# EAGLE design LTC6820 Test Board (EAGLE 9.6.2)
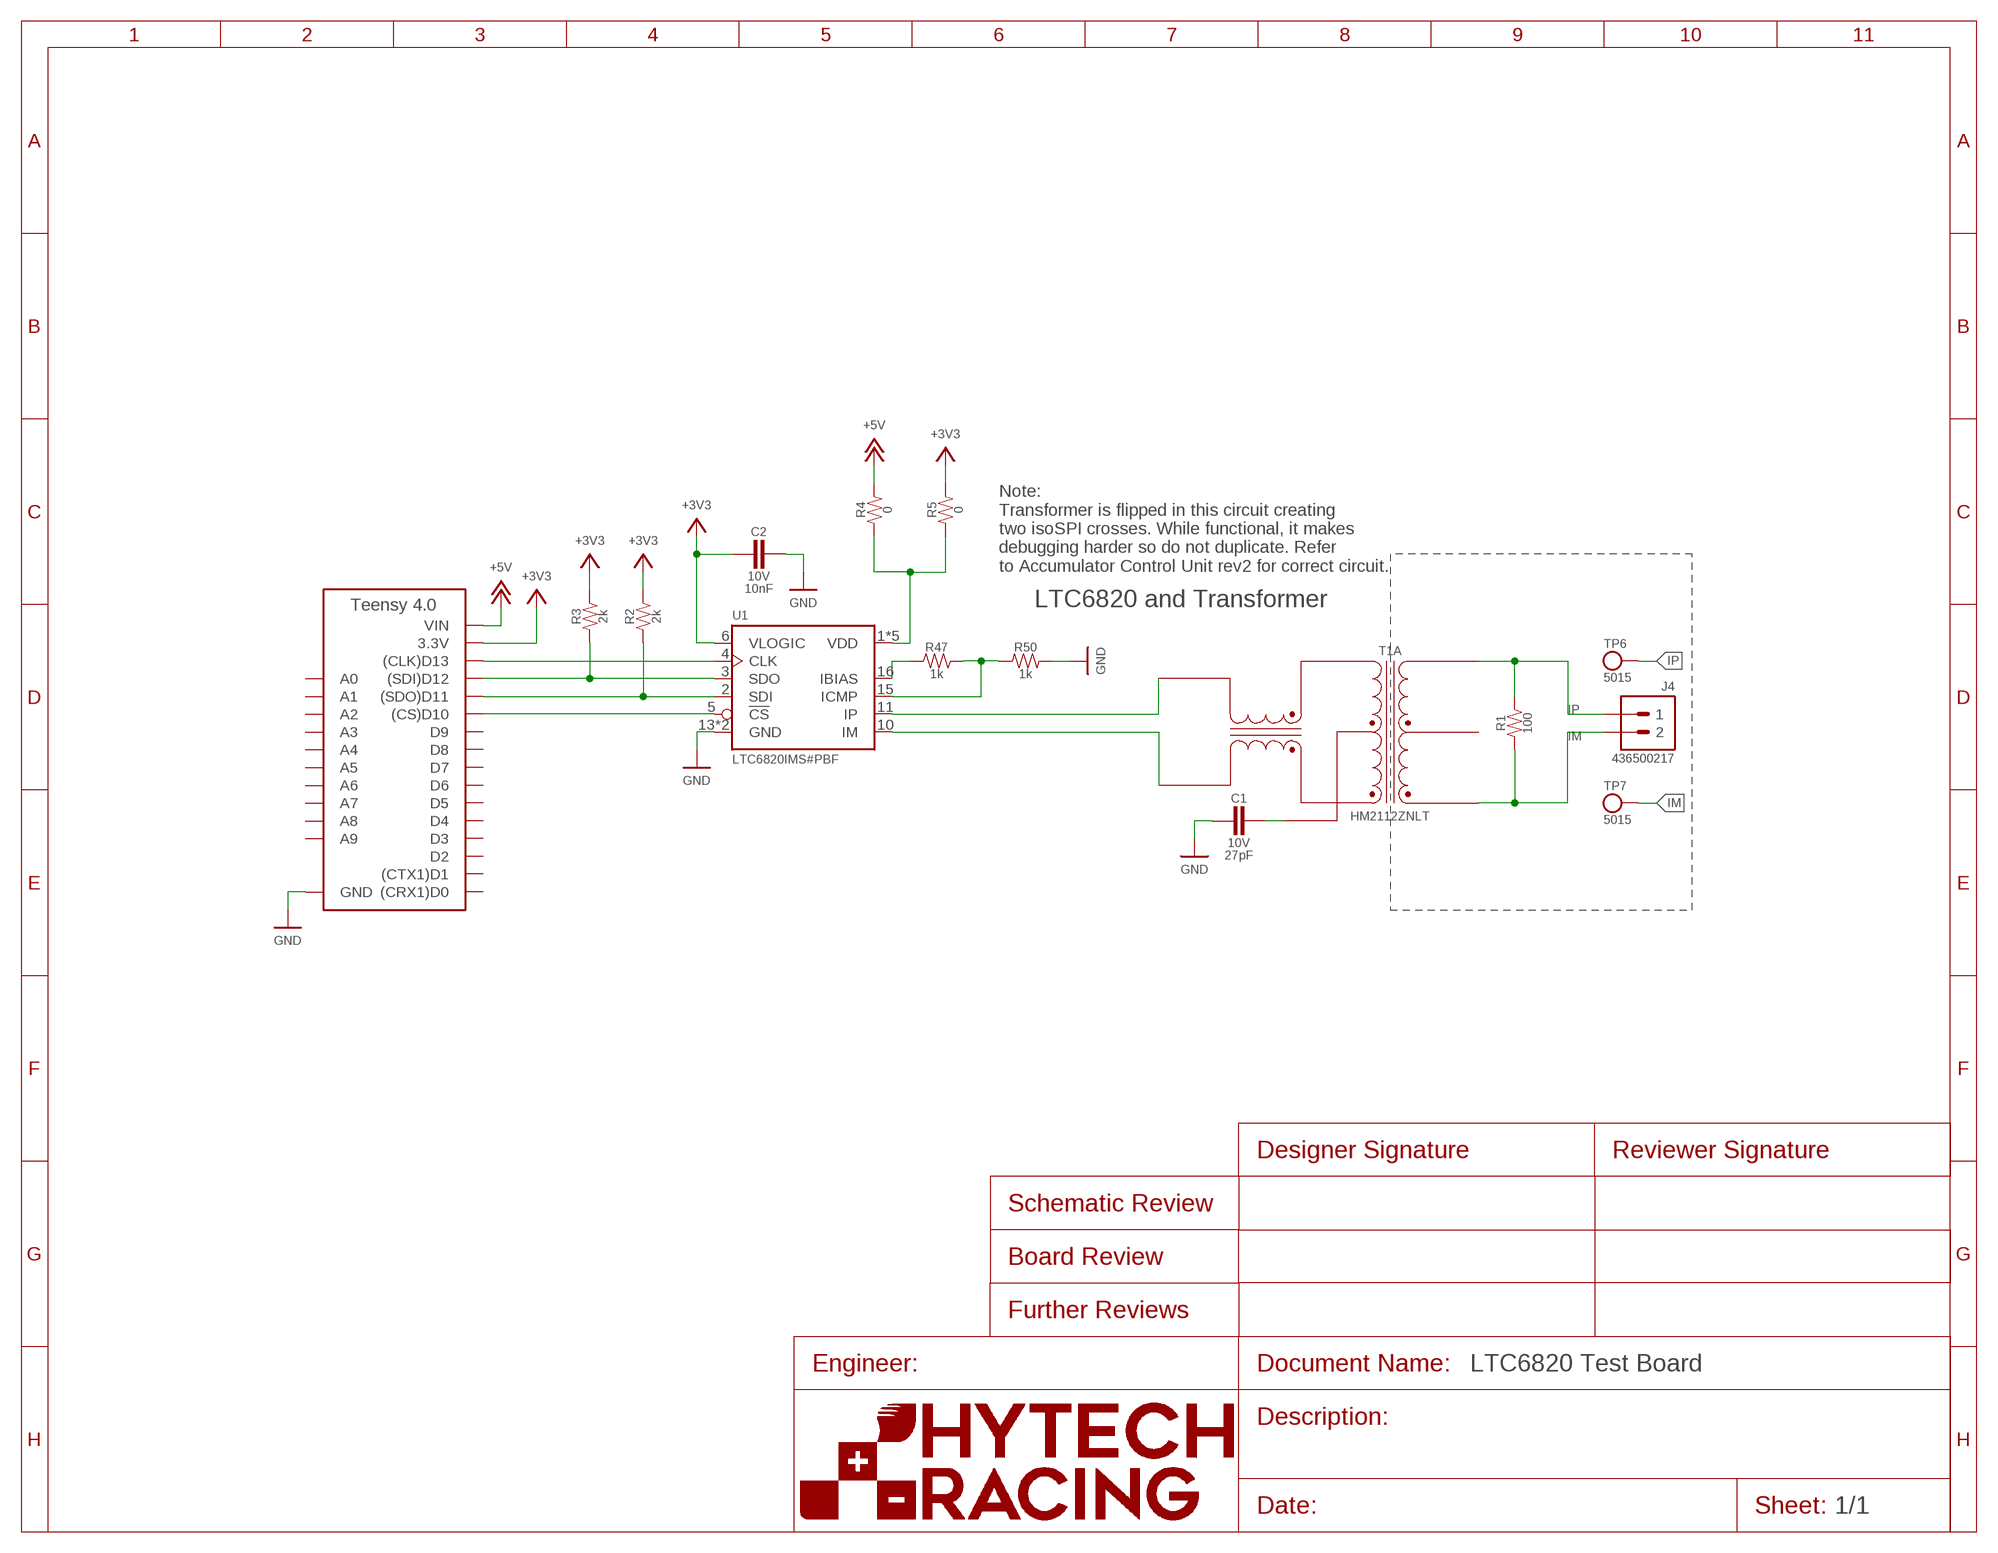
[diagram p0: schematic, sheet 1]

## Parts
A1  TEENSY_4.0  [TEENSY_SHORT]
C1  CAPACITOR_0603_10V_27PF  [0603-CAP]
C2  CAPACITOR_0603_10V_10NF  [0603-CAP]
J4  CONNECTOR-2_MF_T_V_  [MOLEX_MICROFIT_PTH_VERTICAL_02_SINGLE]
R1  RESISTOR_0603_100  [0603-RES]
R2  RESISTOR_0603_2K  [0603-RES]
R3  RESISTOR_0603_2K  [0603-RES]
R4  RESISTOR_0603_0  [0603-RES]
R5  RESISTOR_0603_0  [0603-RES]
R47  RESISTOR_0603_1K  [0603-RES]
R50  RESISTOR_0603_1K  [0603-RES]
T1  TRANSFORMER_HM2112ZNLT_AIRGAP  [HM2112ZNLT_AIRGAP]
TP6  TEST_POINT  [MICRO_MINIATURE]
TP7  TEST_POINT  [MICRO_MINIATURE]
U1  LTC6820  [MSOP-16]

## Nets
+3V3: A1.3.3V C2.2 R2.2 R3.2 R5.2 U1.6(VLOGIC)
+5V: A1.VIN R4.2
GND: A1.AGND/GND(GND) A1.GND C1.2 C2.1 R50.2 U1.13(GND) U1.14(GND)
IM: J4.2 R1.1 T1.1(A:MX+) TP7.1
IP: J4.1 R1.2 T1.3(A:MX-) TP6.1
N$1: C1.1 T1.11(A:TCT)
N$2: A1.D13((CLK)D13) U1.4(CLK)
N$3: A1.D12((SDI)D12) R3.1 U1.3(SDO)
N$4: A1.D11((SDO)D11) R2.1 U1.2(SDI)
N$5: A1.D10((CS)D10) U1.5(!CS)
N$6: R4.1 R5.1 U1.1(VDD) U1.7(VDD) U1.8(VDD) U1.9(VDD) U1.12(VDD)
N$35: T1.10(A:TD-) U1.11(IP)
N$36: R47.1 U1.16(IBIAS)
N$37: R47.2 R50.1 U1.15(ICMP)
N$38: T1.12(A:TD+) U1.10(IM)
Unconnected: A1.D0((CRX1)D0) A1.D1((CTX1)D1) A1.D2 A1.D3 A1.D4 A1.D5 A1.D6 A1.D7 A1.D8 A1.D9 A1.D14(A0) A1.D15(A1) A1.D16(A2) A1.D17(A3) A1.D18(A4) A1.D19(A5) A1.D20(A6) A1.D21(A7) A1.D22(A8) A1.D23(A9) T1.2(A:MCT) T1.4(B:MX+) T1.5(B:MCT) T1.6(B:MX-) T1.7(B:TD-) T1.8(B:TCT) T1.9(B:TD+)

## Notes on the sheet
- Note:
  Transformer is flipped in this circuit creating
  two isoSPI crosses. While functional, it makes 
  debugging harder so do not duplicate. Refer
  to Accumulator Control Unit rev2 for correct circuit.
- LTC6820 and Transformer

## Library data of the parts
A1 = HyTechDevices - Copy:TEENSY_4.0: Teensy 4.0 Datasheet <https://www.pjrc.com/store/teensy40.html>; TEENSY: 4.0
C1 = HyTechDevices - Copy:CAPACITOR_?_*: Capacitor, Non-Polarized VJ...1BC Series Datasheet <https://www.mouser.com/datasheet/2/427/vjw1bcbascomseries-1762447.pdf> Samsung Datasheet <https://www.mouser.com/datasheet/2/585/MLCC-1837944.pdf> Walsin Datasheet <https://www.mouser.com/datasheet/2/210/WTC_MLCC_General_Purpose-1534899.pdf> GRM188R61A226ME15D <https://www.mouser.com/datasheet/2/281/1/GRM188R61A226ME15_02A-1985787.pdf> GRM188R61E106MA73D <https://www.mouser.com/datasheet/2/281/1/GRM188R61E106MA73_01A-1985806.pdf> 885012006013 <https://www.mouser.com/datasheet/2/445/885012006013-1726946.pdf> 2220Y6300105KXTWS2 <https://www.mouser.com/datasheet/2/218/SMD_High_and_Std_StackiCap_P62-1825512.pdf> Yageo Class 2, X5R <https://www.mouser.com/datasheet/2/447/UPY_GPHC_X5R_4V_to_50V_26-1827097.pdf> TDK C Series <https://www.mouser.com/ProductDetail/TDK/C3216X5R1V226M160AC?qs=%2Fha2pyFadujbcx9jh7lYl%2F4NeMoXFhdc8AqVWNq4wW6M2y7zl6GzBuhgtI0ngznN> AVX Automotive MLCC <https://www.mouser.com/datasheet/2/40/AutoMLCC-777028.pdf> KEMET X7R Series <https://www.mouser.com/datasheet/2/212/KEM_C1002_X7R_SMD-1102033.pdf>; CAPACITANCE: 27pF; DKPN: VJ0603A270FXQCW1BC-ND; MANUFACTURER: Vishay Vitramon; MOPN: VJ0603A270FXQCW1BC; MPN: 77-VJ0603A270FXQCBC; TOLERANCE: 1%; VOLTAGE: 10V
C2 = HyTechDevices - Copy:CAPACITOR_?_*: Capacitor, Non-Polarized VJ...1BC Series Datasheet <https://www.mouser.com/datasheet/2/427/vjw1bcbascomseries-1762447.pdf> Samsung Datasheet <https://www.mouser.com/datasheet/2/585/MLCC-1837944.pdf> Walsin Datasheet <https://www.mouser.com/datasheet/2/210/WTC_MLCC_General_Purpose-1534899.pdf> GRM188R61A226ME15D <https://www.mouser.com/datasheet/2/281/1/GRM188R61A226ME15_02A-1985787.pdf> GRM188R61E106MA73D <https://www.mouser.com/datasheet/2/281/1/GRM188R61E106MA73_01A-1985806.pdf> 885012006013 <https://www.mouser.com/datasheet/2/445/885012006013-1726946.pdf> 2220Y6300105KXTWS2 <https://www.mouser.com/datasheet/2/218/SMD_High_and_Std_StackiCap_P62-1825512.pdf> Yageo Class 2, X5R <https://www.mouser.com/datasheet/2/447/UPY_GPHC_X5R_4V_to_50V_26-1827097.pdf> TDK C Series <https://www.mouser.com/ProductDetail/TDK/C3216X5R1V226M160AC?qs=%2Fha2pyFadujbcx9jh7lYl%2F4NeMoXFhdc8AqVWNq4wW6M2y7zl6GzBuhgtI0ngznN> AVX Automotive MLCC <https://www.mouser.com/datasheet/2/40/AutoMLCC-777028.pdf> KEMET X7R Series <https://www.mouser.com/datasheet/2/212/KEM_C1002_X7R_SMD-1102033.pdf>; CAPACITANCE: 10nF; DKPN: 311-4054-1-ND; MANUFACTURER: Yageo; MOPN: 603-CC603KRX7R6BB103; MPN: CC0603KRX7R6BB103; TOLERANCE: 10%; VOLTAGE: 10V
J4 = HyTechDevices - Copy:CONNECTOR-2_?_*: 2 Pin Connector; MANUFACTURER: MOLEX; MPN: 436500217
R1 = HyTechDevices - Copy:RESISTOR_?_*: Resistor PWR163 Series <https://www.mouser.com/datasheet/2/54/pwr163-777985.pdf> AC Series <https://www.mouser.com/datasheet/2/447/Yageo_PYu_AC_51_RoHS_L_7_1714230-1874691.pdf> PU Series <https://www.mouser.com/datasheet/2/447/PYu-PU_51_RoHS_L_6-1504619.pdf> ERA Series <https://www.mouser.com/datasheet/2/315/AOA0000C307-1149632.pdf> PWR263 Series <https://www.mouser.com/datasheet/2/54/pwr263s_35-778069.pdf> RC Series <https://www.mouser.com/datasheet/2/447/Yageo_03_18_2021_PYu_RC_Group_51_RoHS_L_11-2199992.pdf> ERJ PB3, PB6 Series <https://www.mouser.com/datasheet/2/315/AOA0000C328-1530132.pdf> ERJ PA2, P03, PA3, P06, P08, P14 Series <https://www.mouser.com/datasheet/2/315/AOA0000C331-1141874.pdf>; DKPN: 311-100HRCT-ND; MANUFACTURER: Yageo; MOPN: 603-RC0603FR-07100RL; MPN: RC0603FR-07100RL; POWER: 0.1W; RESISTANCE: 100; TOLERANCE: 1%; VOLTAGE_CONTINUOUS: 3.16V; VOLTAGE_MAX: 75V
R2 R3 = HyTechDevices - Copy:RESISTOR_?_*: Resistor PWR163 Series <https://www.mouser.com/datasheet/2/54/pwr163-777985.pdf> AC Series <https://www.mouser.com/datasheet/2/447/Yageo_PYu_AC_51_RoHS_L_7_1714230-1874691.pdf> PU Series <https://www.mouser.com/datasheet/2/447/PYu-PU_51_RoHS_L_6-1504619.pdf> ERA Series <https://www.mouser.com/datasheet/2/315/AOA0000C307-1149632.pdf> PWR263 Series <https://www.mouser.com/datasheet/2/54/pwr263s_35-778069.pdf> RC Series <https://www.mouser.com/datasheet/2/447/Yageo_03_18_2021_PYu_RC_Group_51_RoHS_L_11-2199992.pdf> ERJ PB3, PB6 Series <https://www.mouser.com/datasheet/2/315/AOA0000C328-1530132.pdf> ERJ PA2, P03, PA3, P06, P08, P14 Series <https://www.mouser.com/datasheet/2/315/AOA0000C331-1141874.pdf>; DKPN: P2.0KBDCT-ND; MANUFACTURER: Panasonic Electronic Components; MOPN: 667-ERA-3ARB202V; MPN: ERA-3ARB202V; POWER: 0.1W; RESISTANCE: 2k; TOLERANCE: 0.1%; VOLTAGE_CONTINUOUS: 14.14V; VOLTAGE_MAX: 75V
R4 R5 = HyTechDevices - Copy:RESISTOR_?_*: Resistor PWR163 Series <https://www.mouser.com/datasheet/2/54/pwr163-777985.pdf> AC Series <https://www.mouser.com/datasheet/2/447/Yageo_PYu_AC_51_RoHS_L_7_1714230-1874691.pdf> PU Series <https://www.mouser.com/datasheet/2/447/PYu-PU_51_RoHS_L_6-1504619.pdf> ERA Series <https://www.mouser.com/datasheet/2/315/AOA0000C307-1149632.pdf> PWR263 Series <https://www.mouser.com/datasheet/2/54/pwr263s_35-778069.pdf> RC Series <https://www.mouser.com/datasheet/2/447/Yageo_03_18_2021_PYu_RC_Group_51_RoHS_L_11-2199992.pdf> ERJ PB3, PB6 Series <https://www.mouser.com/datasheet/2/315/AOA0000C328-1530132.pdf> ERJ PA2, P03, PA3, P06, P08, P14 Series <https://www.mouser.com/datasheet/2/315/AOA0000C331-1141874.pdf>; DKPN: 311-0.0HRCT-ND; MANUFACTURER: Yageo; MOPN: 603-RC0603FR-070RL; MPN: RC0603FR-070RL; POWER: 0.1W; RESISTANCE: 0; TOLERANCE: 1%; VOLTAGE_CONTINUOUS: 75V; VOLTAGE_MAX: 75V
R47 R50 = HyTechDevices - Copy:RESISTOR_?_*: Resistor PWR163 Series <https://www.mouser.com/datasheet/2/54/pwr163-777985.pdf> AC Series <https://www.mouser.com/datasheet/2/447/Yageo_PYu_AC_51_RoHS_L_7_1714230-1874691.pdf> PU Series <https://www.mouser.com/datasheet/2/447/PYu-PU_51_RoHS_L_6-1504619.pdf> ERA Series <https://www.mouser.com/datasheet/2/315/AOA0000C307-1149632.pdf> PWR263 Series <https://www.mouser.com/datasheet/2/54/pwr263s_35-778069.pdf> RC Series <https://www.mouser.com/datasheet/2/447/Yageo_03_18_2021_PYu_RC_Group_51_RoHS_L_11-2199992.pdf> ERJ PB3, PB6 Series <https://www.mouser.com/datasheet/2/315/AOA0000C328-1530132.pdf> ERJ PA2, P03, PA3, P06, P08, P14 Series <https://www.mouser.com/datasheet/2/315/AOA0000C331-1141874.pdf>; DKPN: 311-1.00KHRCT-ND; MANUFACTURER: Yageo; MOPN: 603-RC0603FR-071KL; MPN: RC0603FR-071KL; POWER: 0.1W; RESISTANCE: 1k; TOLERANCE: 1%; VOLTAGE_CONTINUOUS: 10.00V; VOLTAGE_MAX: 75V
T1 = HyTechDevices - Copy:TRANSFORMER: 2 Channel SMT Transformer Specs for both HM2102NL and HM2112ZNL Transformers Turns ratio: 1CT: 1CT Isolation Voltage: 4300 VDC Inductance: 150 uH Leakage Inductance: 0.50 uH max HM2102NLT: DataSheet <https://www.mouser.com/datasheet/2/336/HM2102NL-1218600.pdf> HM2112ZNLT: DataSheet <https://www.mouser.com/datasheet/2/336/HM2112ZNL-1224892.pdf>; DKPN: 1840-1036-1-ND; MANUFACTURER: Pulse Electronics; MOPN: 673-HM2112ZNLT; MPN: HM2112ZNLT
TP6 TP7 = HyTechDevices - Copy:TEST_POINT: Test Point; DKPN: 36-5015CT-ND; MANUFACTURER: Keystone Electronics; MOPN: 534-5015; MPN: 5015
U1 = HyTechDevices - Copy:LTC6820: LTC6820 isoSPI Isolated Communications Interface Datasheet <mouser.com/datasheet/2/609/LTC6820-1601976.pdf>; MANUFACTURER: Analog Devices; MPN: LTC6820IMS#PBF

## Board
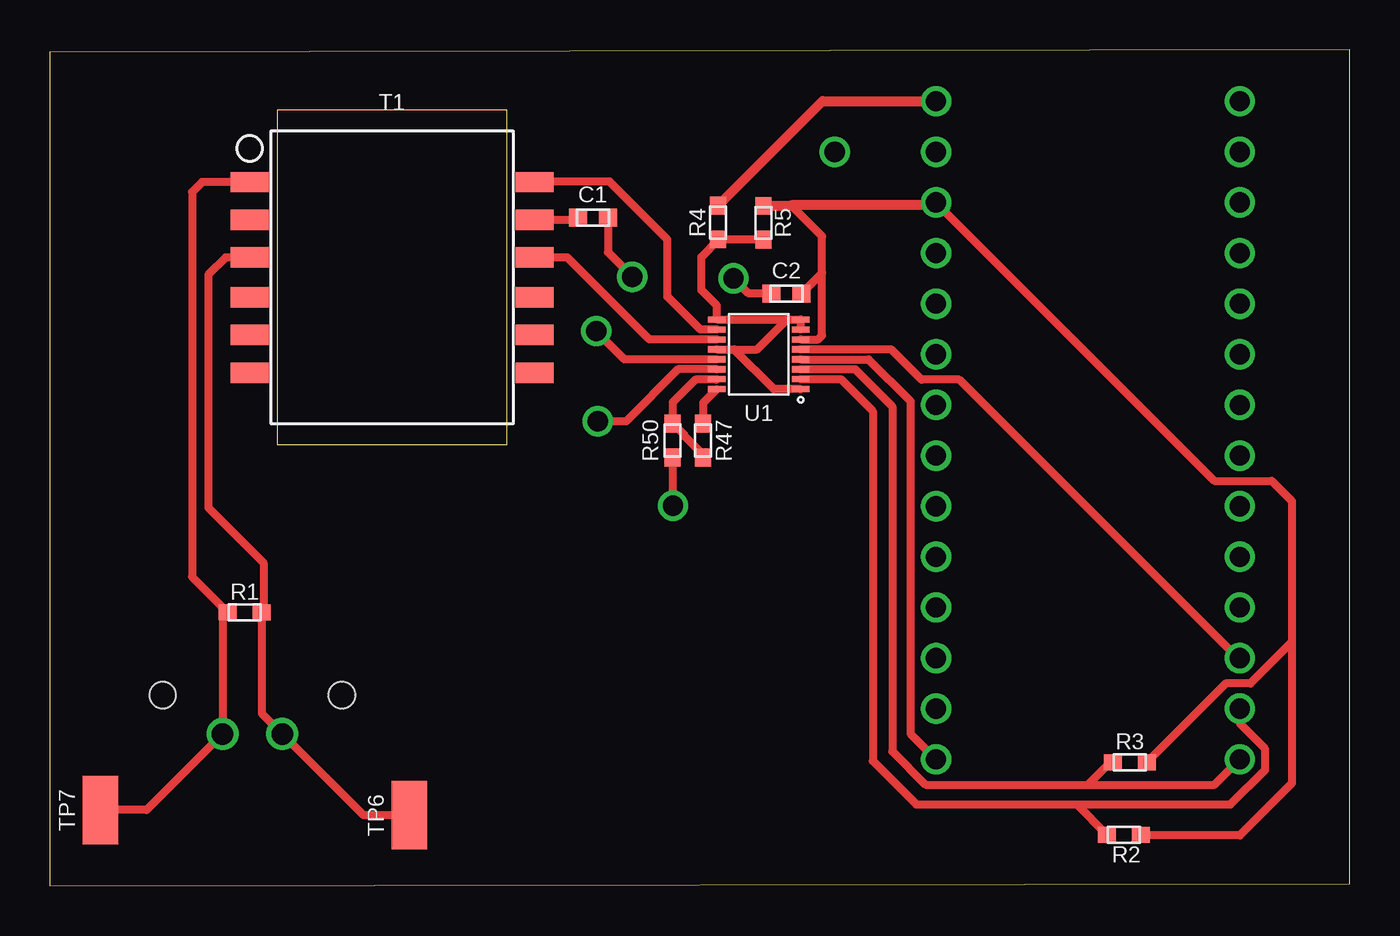
[diagram p1: board, top side]
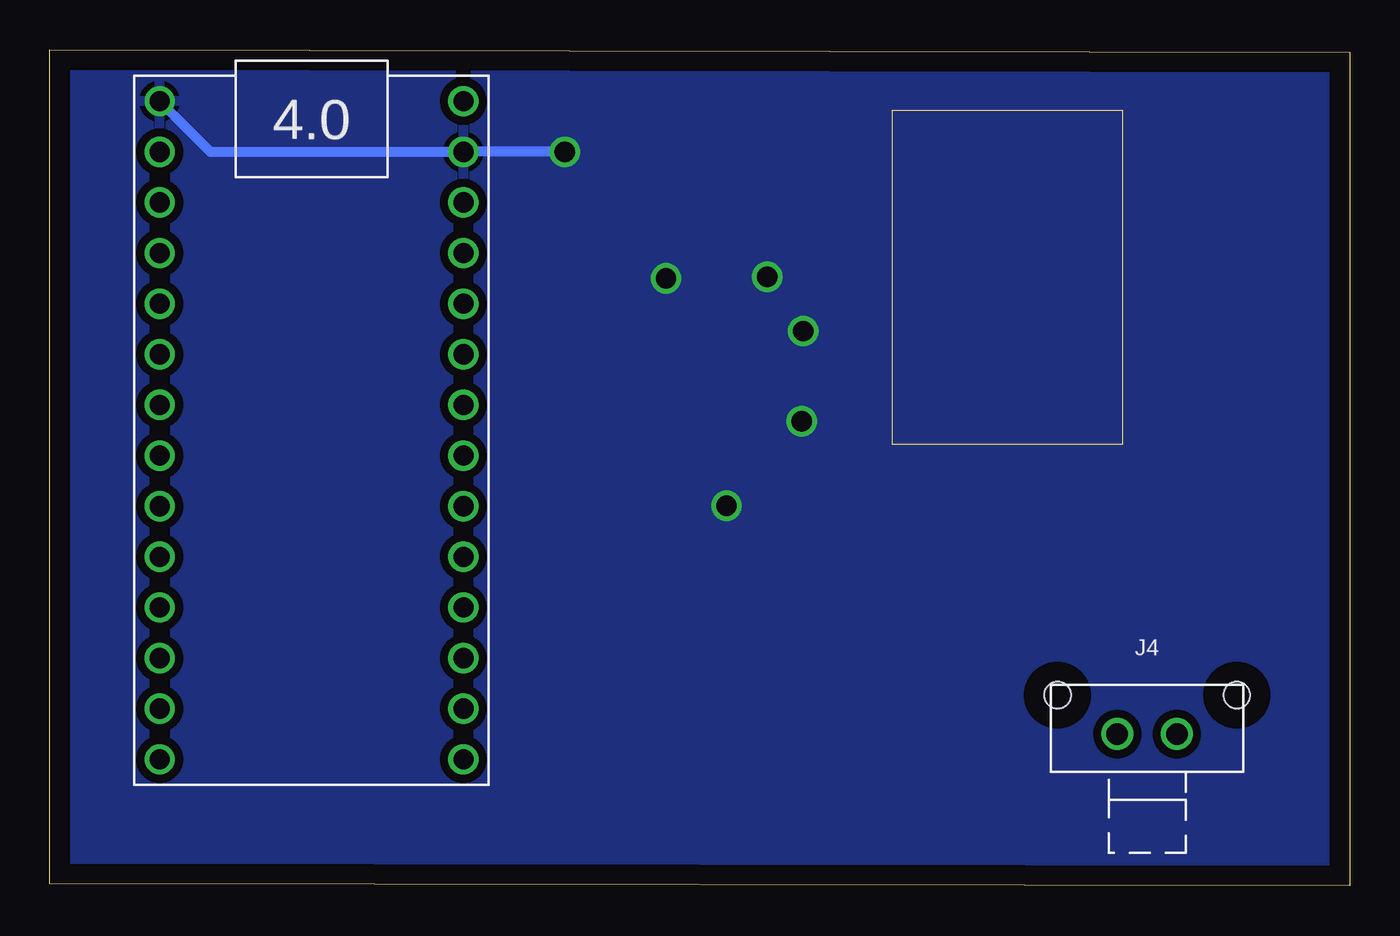
[diagram p2: board, bottom side, seen from below]

Size 65.2 x 41.95 mm. Coordinates in mm from the lower left corner, seen from the top.
Outline: 0,0 65.2,0.11 65.2,41.95 0,41.83 0,0
Copper layers (1*16): Top 0.035mm / dielectric 1.5mm / Bottom 0.035mm
Design rules "On Campus (2 Layer)": minimum track width 16mil, minimum drill 0.8mm, track to track 16mil, track to pad 12mil, pad to pad 16mil, via to via 16mil, smd to smd 10mil, copper to edge 40mil, drill to drill 10mil, minimum pad ring 10mil, minimum via ring 8mil, stop-mask expansion 4mil, vias tented up to drill 0mil, thermal gap 10mil

### Footprints (pad centres in the part's own frame; a part is rotated, then mirrored left to right if it is on the bottom)
TEENSY_SHORT = drill 1.016: 3.3V 0,5.08; AGND/GND 0,2.54; D0 15.24,2.54; D1 15.24,5.08; D2 15.24,7.62; D3 15.24,10.16; D4 15.24,12.7; D5 15.24,15.24; D6 15.24,17.78; D7 15.24,20.32; D8 15.24,22.86; D9 15.24,25.4; D10 15.24,27.94; D11 15.24,30.48; D12 15.24,33.02; D13 0,33.02; D14 0,30.48; D15 0,27.94; D16 0,25.4; D17 0,22.86; D18 0,20.32; D19 0,17.78; D20 0,15.24; D21 0,12.7; D22 0,10.16; D23 0,7.62; GND 15.24,0; VIN 0,0
0603-CAP = smd 0.9 x 0.9: 1 -0.75,0; 2 0.75,0
MOLEX_MICROFIT_PTH_VERTICAL_02_SINGLE = drill 1.067: 1 1.499,0; 2 -1.499,0 | hole 1.321: 4.496,-1.956; -4.496,-1.956
0603-RES = smd 0.9 x 0.8: 1 -0.85,0; 2 0.85,0
HM2112ZNLT_AIRGAP = smd 1.02 x 1.89: 1 -4.78,-7.145; 2 -2.89,-7.145; 3 -1,-7.145; 4 1,-7.145; 5 2.875,-7.145; 6 4.78,-7.145; 7 4.78,7.145; 8 2.89,7.145; 9 1,7.145; 10 -1,7.145; 11 -2.89,7.145; 12 -4.78,7.145
MICRO_MINIATURE = smd 3.429 x 1.778: 1 0,0
MSOP-16 = smd 0.305 x 0.889: 1 -1.75,-2.106; 2 -1.25,-2.106; 3 -0.75,-2.106; 4 -0.25,-2.106; 5 0.25,-2.106; 6 0.75,-2.106; 7 1.25,-2.106; 8 1.75,-2.106; 9 1.75,2.106; 10 1.25,2.106; 11 0.75,2.106; 12 0.25,2.106; 13 -0.25,2.106; 14 -0.75,2.106; 15 -1.25,2.106; 16 -1.75,2.106

### Placement (x,y rotation side)
A1  44.45,39.37 180 bottom
C1  27.24,33.53 0 top
C2  36.96,29.72 0 top
J4  10.16,7.62 180 bottom
R1  9.78,13.72 0 top
R2  53.87,2.57 0 top
R3  54.18,6.21 0 top
R4  33.52,33.29 90 top
R5  35.79,33.27 90 top
R47  32.77,22.35 270 top
R50  31.24,22.35 270 top
T1  17.17,30.53 270 top
TP6  18.03,3.56 90 top
TP7  2.54,3.81 90 top
U1  35.56,26.67 90 top

### Tracks (layer width: path | path; a pad name or v marks a point on that pad's centre or on a via)
+3V3
  Top 0.406: 38.73,30.75 38.73,32.6 37.22,34.12 37.19,34.15 | 38.73,30.75 C2.2 | U1.6 38.52,27.42 38.53,27.41 38.73,27.62 38.73,30.75 | A1.3.3V 58.42,20.32 61.29,20.32 62.3,19.31 62.3,12.24 | R3.2 58.98,10.16 60.22,10.16 62.3,12.24 | 62.3,12.24 62.3,5.15 59.69,2.54 54.75,2.54 R2.2
  Top 0.508: 37.19,34.15 44.3,34.15 A1.3.3V | 37.22,34.12 R5.2
+5V
  Top 0.508: R4.2 38.76,39.37 A1.VIN
GND  (via drill 1.02)
  Top 0.406: U1.13 28.82,26.42 v27.41,27.84 | U1.14 31.52,25.92 28.9,23.3 v27.48,23.3 | C1.2 27.99,31.79 v29.22,30.56 | R50.2 31.24,19.09 v31.26,19.08 | C2.1 35.05,29.72 v34.29,30.48
  Bottom 0.508: A1.GND 57.15,36.83 A1.AGND/GND v39.37,36.83
  pour Bottom: -1.27,43.18 -1.27,-1.27 66.04,-1.27 66.04,43.18
IM
  Top 0.406: T1.1 7.63,35.31 7.13,34.81 7.13,15.51 R1.1 8.66,13.45 J4.2 4.85,3.81 TP7.1
IP
  Top 0.406: T1.3 8.81,31.53 7.94,30.66 7.94,18.98 10.72,16.21 10.72,13.8 R1.2 10.63,8.65 J4.1 15.72,3.56 TP6.1
N$1
  Top 0.152: 26.49,33.42 C1.1
  Top 0.406: T1.11 26.49,33.42
N$2
  Top 0.406: U1.4 41.07,26.42 43.17,24.32 43.17,7.63 A1.D13
N$3
  Top 0.406: 52.07,5.08 43.92,5.08 42.26,6.75 42.26,24.05 40.39,25.92 U1.3 | 52.07,5.08 58.42,5.08 A1.D12 | 52.07,5.08 53.2,6.21 R3.1
N$4
  Top 0.406: U1.2 39.68,25.42 41.28,23.82 41.28,6.26 43.46,4.09 51.5,4.09 | 51.5,4.09 59.22,4.09 60.96,5.82 60.96,6.88 59.69,8.15 A1.D11 | R2.1 51.5,4.09
N$5
  Top 0.406: U1.5 42.2,26.92 43.72,25.4 45.61,25.4 59.59,11.43 A1.D10
N$6
  Top 0.406: U1.7 U1.8 36.97,28.42 | 36.97,28.42 U1.9 33.45,29.12 32.69,29.89 32.69,31.56 33.54,32.42 | R5.1 33.54,32.42 | 33.54,32.42 R4.1 | U1.12 34.32,26.92 | 34.32,26.92 35.47,26.92 36.97,28.42 | U1.1 36.32,24.92 34.32,26.92
N$35
  Top 0.406: T1.10 25.97,31.53 30.08,27.42 U1.11
N$36
  Top 0.406: U1.16 32.77,24.23 R47.1
N$37
  Top 0.406: U1.15 33.43,25.4 32.38,25.4 31.24,24.26 R50.1 31.86,22.59 31.86,22.54 32.77,21.63 R47.2
N$38
  Top 0.406: T1.12 24.34,35.34 28.08,35.34 30.98,32.43 30.98,29.57 32.63,27.92 U1.10